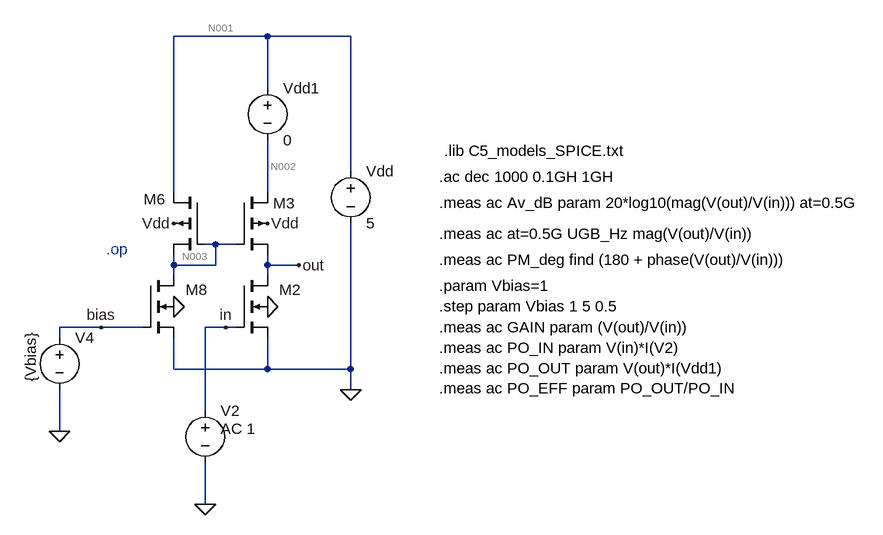
[diagram p0: schematic CMOS class AB Output STAGES_FINAL.asc]
CMOS class AB Output STAGES_FINAL.asc, the LTspice schematic file:
Version 4
SHEET 1 1260 1012
WIRE -208 -224 -352 -224
WIRE -80 -224 -208 -224
WIRE -208 -144 -208 -224
WIRE -80 -16 -80 -224
WIRE -352 16 -352 -224
WIRE -208 16 -208 -64
WIRE -288 96 -304 96
WIRE -256 96 -288 96
WIRE -352 128 -352 112
WIRE -288 128 -288 96
WIRE -288 128 -352 128
WIRE -208 128 -208 112
WIRE -160 128 -208 128
WIRE -352 144 -352 128
WIRE -208 144 -208 128
WIRE -464 224 -528 224
WIRE -400 224 -464 224
WIRE -272 224 -304 224
WIRE -256 224 -272 224
WIRE -528 240 -528 224
WIRE -352 288 -352 240
WIRE -208 288 -208 240
WIRE -208 288 -352 288
WIRE -80 288 -80 64
WIRE -80 288 -208 288
WIRE -80 320 -80 288
WIRE -304 352 -304 224
WIRE -528 384 -528 320
WIRE -304 496 -304 432
FLAG -528 384 0
FLAG -208 64 Vdd
FLAG -352 64 Vdd
FLAG -352 192 0
FLAG -208 192 0
FLAG -160 128 out
FLAG -464 224 bias
FLAG -272 224 in
FLAG -80 320 0
FLAG -304 496 0
SYMBOL nmos4 -400 144 R0
WINDOW 0 66 22 Left 2
WINDOW 3 56 72 Invisible 2
SYMATTR InstName M8
SYMATTR Value2 l=0.6u w=5u
SYMBOL pmos4 -304 16 M0
WINDOW 0 61 11 Left 2
WINDOW 3 56 72 Invisible 2
SYMATTR InstName M6
SYMATTR Value2 l=0.6u w=10u
SYMBOL voltage -528 224 R0
WINDOW 123 0 0 Left 0
WINDOW 39 0 0 Left 0
WINDOW 3 -44 7 VRight 2
SYMATTR Value {Vbias}
SYMATTR InstName V4
SYMBOL pmos4 -256 16 R0
WINDOW 0 57 17 Left 2
WINDOW 3 56 72 Invisible 2
SYMATTR InstName M3
SYMATTR Value2 l=0.6u w=10u
SYMBOL voltage -80 -32 R0
WINDOW 123 0 0 Left 0
WINDOW 39 0 0 Left 0
SYMATTR InstName Vdd
SYMATTR Value 5
SYMBOL nmos4 -256 144 R0
WINDOW 0 66 22 Left 2
WINDOW 3 56 72 Invisible 2
SYMATTR InstName M2
SYMATTR Value2 l=0.6u w=5u
SYMBOL voltage -304 336 R0
WINDOW 123 24 44 Left 2
WINDOW 39 0 0 Left 0
WINDOW 3 24 44 Left 2
SYMATTR Value2 AC 1
SYMATTR Value ""
SYMATTR InstName V2
SYMBOL voltage -208 -160 R0
WINDOW 123 0 0 Left 0
WINDOW 39 0 0 Left 0
SYMATTR InstName Vdd1
SYMATTR Value 0
TEXT 56 -8 Left 2 !.ac dec 1000 0.1GH 1GH
TEXT -456 104 Left 2 ;.op
TEXT 56 32 Left 2 !.meas ac Av_dB param 20*log10(mag(V(out)/V(in))) at=0.5G
TEXT 56 80 Left 2 !.meas ac at=0.5G UGB_Hz mag(V(out)/V(in))
TEXT 56 120 Left 2 !.meas ac PM_deg find (180 + phase(V(out)/V(in)))
TEXT 64 -48 Left 2 !.lib C5_models_SPICE.txt
TEXT 56 160 Left 2 !.param Vbias=1\n.step param Vbias 1 5 0.5
TEXT 56 224 Left 2 !.meas ac GAIN param (V(out)/V(in))\n.meas ac PO_IN param V(in)*I(V2)\n.meas ac PO_OUT param V(out)*I(Vdd1)\n.meas ac PO_EFF param PO_OUT/PO_IN

The netlist it stands for:
* CMOS class AB Output STAGES_FINAL.asc
M8 N003 bias 0 0 NMOS l=0.6u w=5u
M6 N001 N003 N003 Vdd PMOS l=0.6u w=10u
V4 bias 0 {Vbias}
M3 N002 N003 out Vdd PMOS l=0.6u w=10u
Vdd N001 0 5
M2 out in 0 0 NMOS l=0.6u w=5u
V2 in 0 AC 1
Vdd1 N001 N002 0
.model NMOS NMOS
.model PMOS PMOS
.lib standard.mos
.ac dec 1000 0.1GH 1GH
* .op
.meas ac Av_dB param 20*log10(mag(V(out)/V(in))) at=0.5G
.meas ac at=0.5G UGB_Hz mag(V(out)/V(in))
.meas ac PM_deg find (180 + phase(V(out)/V(in)))
.lib C5_models_SPICE.txt
.param Vbias=1
.step param Vbias 1 5 0.5
.meas ac GAIN param (V(out)/V(in))
.meas ac PO_IN param V(in)*I(V2)
.meas ac PO_OUT param V(out)*I(Vdd1)
.meas ac PO_EFF param PO_OUT/PO_IN
.backanno
.end

* Results of the author's LTspice run, read from the files saved beside the schematic
* Operating Point (first step), zero values left out:
*   vbias = 1 
*   V(n003) = 3.74 V
*   V(bias) = 1 V
*   V(n001) = 5 V
*   V(vdd) = 4.865 V
*   V(n002) = 5 V
*   V(out) = 5 V
*   Id(M8) = 62.38 µA
*   Ib(M8) = -3.75 pA
*   Is(M8) = -62.38 µA
*   Id(M2) = 5.046 pA
*   Ib(M2) = -5.01 pA
*   Id(M6) = 62.38 µA
*   Is(M6) = -62.38 µA
*   Id(M3) = 9.052 pA
*   Ib(M3) = -4.013 pA
*   Is(M3) = -5.039 pA
*   I(Vdd) = -62.38 µA
*   I(Vdd1) = 9.045 pA
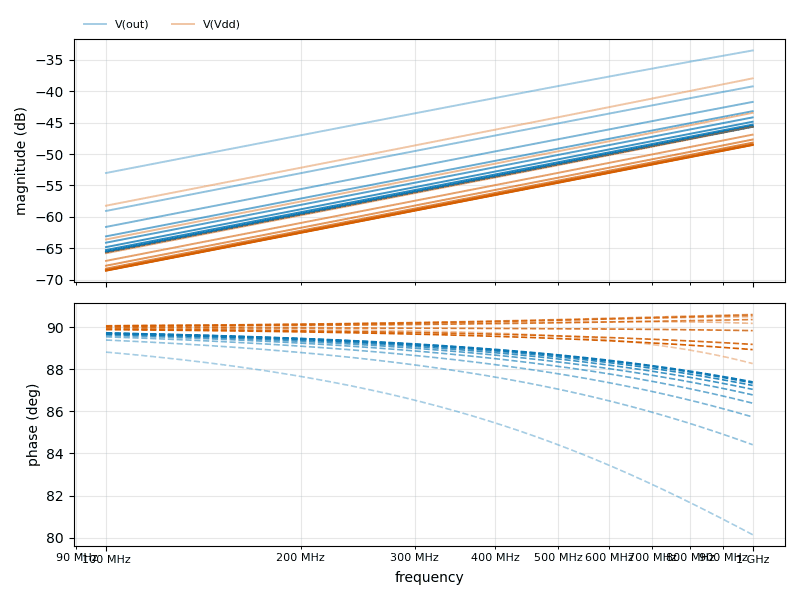
[diagram p1: AC Analysis of CMOS class AB Output STAGES_FINAL.asc, plotted from the saved traces]
* AC Analysis, 9 runs:
*   V(out) [vbias=1]: -53.02 dB at 100 MHz, -33.52 dB at 1 GHz, peak -33.52 dB at 1 GHz, 3 dB below the peak at 688.7 MHz
*   V(out) [vbias=1.5]: -59.06 dB at 100 MHz, -39.23 dB at 1 GHz, peak -39.23 dB at 1 GHz, 3 dB below the peak at 700.2 MHz
*   V(out) [vbias=2]: -61.60 dB at 100 MHz, -41.71 dB at 1 GHz, peak -41.71 dB at 1 GHz, 3 dB below the peak at 702.8 MHz
*   V(out) [vbias=2.5]: -63.10 dB at 100 MHz, -43.18 dB at 1 GHz, peak -43.18 dB at 1 GHz, 3 dB below the peak at 703.9 MHz
*   V(out) [vbias=3]: -64.11 dB at 100 MHz, -44.17 dB at 1 GHz, peak -44.17 dB at 1 GHz, 3 dB below the peak at 704.5 MHz
*   V(out) [vbias=3.5]: -64.81 dB at 100 MHz, -44.86 dB at 1 GHz, peak -44.86 dB at 1 GHz, 3 dB below the peak at 705 MHz
*   V(out) [vbias=4]: -65.27 dB at 100 MHz, -45.31 dB at 1 GHz, peak -45.31 dB at 1 GHz, 3 dB below the peak at 705.4 MHz
*   V(out) [vbias=4.5]: -65.51 dB at 100 MHz, -45.54 dB at 1 GHz, peak -45.54 dB at 1 GHz, 3 dB below the peak at 705.8 MHz
*   V(Vdd) [vbias=1]: -58.22 dB at 100 MHz, -37.95 dB at 1 GHz, peak -37.95 dB at 1 GHz, 3 dB below the peak at 715.5 MHz
*   V(Vdd) [vbias=1.5]: -63.59 dB at 100 MHz, -43.44 dB at 1 GHz, peak -43.44 dB at 1 GHz, 3 dB below the peak at 712.7 MHz
*   V(Vdd) [vbias=2]: -65.78 dB at 100 MHz, -45.67 dB at 1 GHz, peak -45.67 dB at 1 GHz, 3 dB below the peak at 711.4 MHz
*   V(Vdd) [vbias=2.5]: -67.00 dB at 100 MHz, -46.91 dB at 1 GHz, peak -46.91 dB at 1 GHz, 3 dB below the peak at 710.6 MHz
*   V(Vdd) [vbias=3]: -67.77 dB at 100 MHz, -47.69 dB at 1 GHz, peak -47.69 dB at 1 GHz, 3 dB below the peak at 710.1 MHz
*   V(Vdd) [vbias=3.5]: -68.24 dB at 100 MHz, -48.18 dB at 1 GHz, peak -48.18 dB at 1 GHz, 3 dB below the peak at 709.3 MHz
*   V(Vdd) [vbias=4]: -68.48 dB at 100 MHz, -48.45 dB at 1 GHz, peak -48.45 dB at 1 GHz, 3 dB below the peak at 708.3 MHz
*   V(Vdd) [vbias=4.5]: -68.53 dB at 100 MHz, -48.52 dB at 1 GHz, peak -48.52 dB at 1 GHz, 3 dB below the peak at 707.4 MHz
* From the log:
*   Measurement: av_db
*     step  20*log10(mag(v(out)/v(in)))
*        1  (30.5055dB,180°)
*        2  (31.8728dB,180°)
*        3  (32.404dB,180°)
*        4  (32.706dB,180°)
*        5  (32.9028dB,180°)
*        6  (33.0375dB,180°)
*        7  (33.1241dB,180°)
*        8  (33.1687dB,180°)
*        9  (33.1903dB,180°)
*   Measurement: at=0.5g
*     step  at=0.5g  FROM  TO
*        1  9e+08  1e+08  1e+09
*        2  9e+08  1e+08  1e+09
*        3  9e+08  1e+08  1e+09
*        4  9e+08  1e+08  1e+09
*        5  9e+08  1e+08  1e+09
*        6  9e+08  1e+08  1e+09
*        7  9e+08  1e+08  1e+09
*        8  9e+08  1e+08  1e+09
*        9  9e+08  1e+08  1e+09
*   Measurement: gain
*     step  (v(out)/v(in))
*        1  (-33.5178dB,80.1331°)
*        2  (-39.2318dB,84.417°)
*        3  (-41.7061dB,85.7383°)
*        4  (-43.1816dB,86.3953°)
*        5  (-44.1714dB,86.7905°)
*        6  (-44.8617dB,87.0537°)
*        7  (-45.3114dB,87.2383°)
*        8  (-45.5442dB,87.3554°)
*        9  (-45.6576dB,87.4092°)
*   Measurement: po_in
*     step  v(in)*i(v2)
*        1  (-90.5669dB,-90.2275°)
*        2  (-90.5627dB,-90.119°)
*        3  (-90.5619dB,-90.0897°)
*        4  (-90.5617dB,-90.0757°)
*        5  (-90.5615dB,-90.0676°)
*        6  (-90.5614dB,-90.0624°)
*        7  (-90.5614dB,-90.0593°)
*        8  (-90.5613dB,-90.0577°)
*        9  (-90.5613dB,-90.057°)
*   Measurement: po_out
*     step  v(out)*i(vdd1)
*        1  (-139.318dB,-25.1975°)
*        2  (-144.475dB,-14.3237°)
*        3  (-146.834dB,-10.9336°)
*        4  (-148.262dB,-9.24149°)
*        5  (-149.225dB,-8.21995°)
*        6  (-149.895dB,-7.53397°)
*        7  (-150.323dB,-7.042°)
*        8  (-150.535dB,-6.71987°)
*        9  (-150.641dB,-6.57313°)
*   Measurement: po_eff
*     step  po_out/po_in
*        1  (-48.7516dB,65.0301°)
*        2  (-53.9127dB,75.7953°)
*        3  (-56.2725dB,79.1561°)
*        4  (-57.7007dB,80.8342°)
*        5  (-58.6635dB,81.8476°)
*        6  (-59.3331dB,82.5285°)
*        7  (-59.7612dB,83.0173°)
*        8  (-59.9741dB,83.3379°)
*        9  (-60.0797dB,83.4839°)